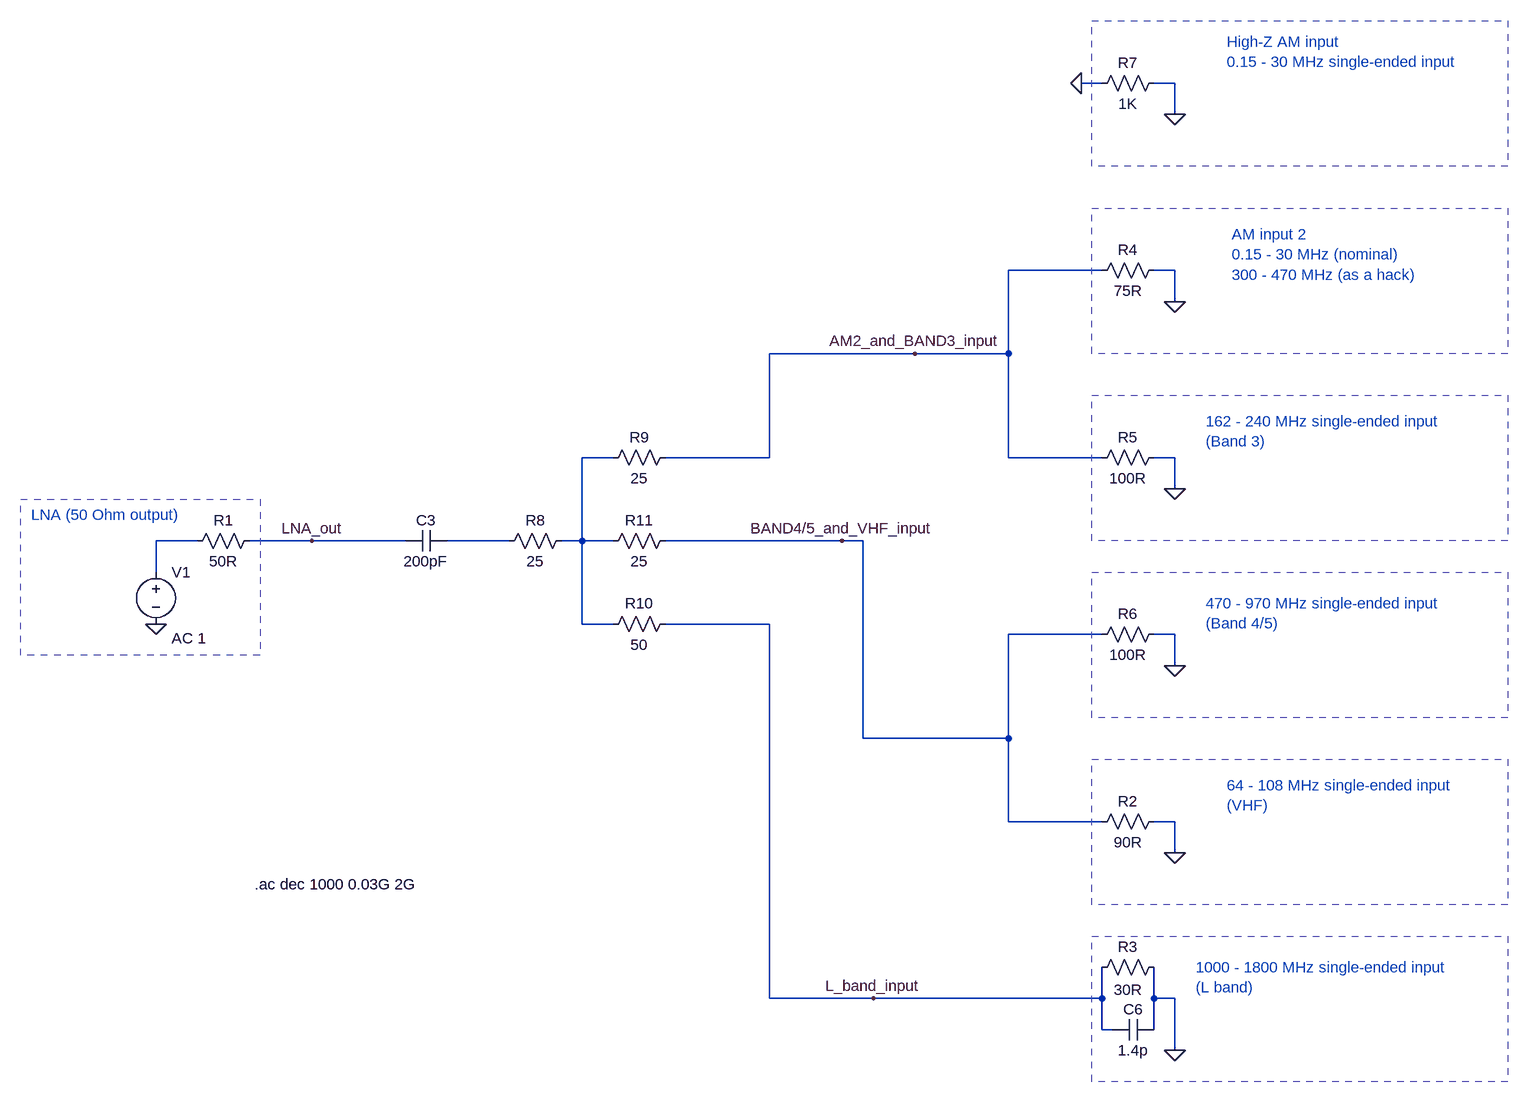
[diagram p0: schematic antenna_input_coupling_resistive_1.1.asc]
antenna_input_coupling_resistive_1.1.asc, the LTspice schematic file:
Version 4
SHEET 1 1332 1684
WIRE 464 -432 432 -432
WIRE 576 -432 544 -432
WIRE 576 -384 576 -432
WIRE 464 -144 320 -144
WIRE 576 -144 544 -144
WIRE 576 -96 576 -144
WIRE 176 -16 -48 -16
WIRE 320 -16 320 -144
WIRE 320 -16 176 -16
WIRE -288 144 -336 144
WIRE -48 144 -48 -16
WIRE -48 144 -208 144
WIRE 320 144 320 -16
WIRE 464 144 320 144
WIRE 576 144 544 144
WIRE 576 192 576 144
WIRE -928 272 -992 272
WIRE -752 272 -848 272
WIRE -608 272 -752 272
WIRE -448 272 -544 272
WIRE -336 272 -336 144
WIRE -336 272 -368 272
WIRE -288 272 -336 272
WIRE 64 272 -208 272
WIRE 96 272 64 272
WIRE -992 320 -992 272
WIRE -336 400 -336 272
WIRE -288 400 -336 400
WIRE -48 400 -208 400
WIRE 464 416 320 416
WIRE 576 416 544 416
WIRE 576 464 576 416
WIRE 96 576 96 272
WIRE 320 576 320 416
WIRE 320 576 96 576
WIRE 320 704 320 576
WIRE 464 704 320 704
WIRE 576 704 544 704
WIRE 576 752 576 704
WIRE -48 976 -48 400
WIRE 112 976 -48 976
WIRE 464 976 464 928
WIRE 464 976 112 976
WIRE 544 976 544 928
WIRE 576 976 544 976
WIRE 464 1024 464 976
WIRE 480 1024 464 1024
WIRE 544 1024 544 976
WIRE 576 1056 576 976
FLAG -992 400 0
FLAG 576 752 0
FLAG 576 192 0
FLAG 576 464 0
FLAG 576 1056 0
FLAG 576 -96 0
FLAG 576 -384 0
FLAG 432 -432 0
FLAG -752 272 LNA_out
FLAG 176 -16 AM2_and_BAND3_input
FLAG 64 272 BAND4/5_and_VHF_input
FLAG 112 976 L_band_input
SYMBOL res -832 256 R90
WINDOW 0 0 56 VBottom 2
WINDOW 3 32 56 VTop 2
SYMATTR InstName R1
SYMATTR Value 50R
SYMBOL voltage -992 304 R0
WINDOW 123 24 118 Left 2
SYMATTR Value2 AC 1
SYMATTR InstName V1
SYMATTR Value ""
SYMBOL res 560 688 R90
WINDOW 0 0 56 VBottom 2
WINDOW 3 32 56 VTop 2
SYMATTR InstName R2
SYMATTR Value 90R
SYMBOL res 560 128 R90
WINDOW 0 0 56 VBottom 2
WINDOW 3 32 56 VTop 2
SYMATTR InstName R5
SYMATTR Value 100R
SYMBOL res 560 400 R90
WINDOW 0 0 56 VBottom 2
WINDOW 3 32 56 VTop 2
SYMATTR InstName R6
SYMATTR Value 100R
SYMBOL res 560 912 R90
WINDOW 0 0 56 VBottom 2
WINDOW 3 35 56 VTop 2
SYMATTR InstName R3
SYMATTR Value 30R
SYMBOL res 560 -160 R90
WINDOW 0 0 56 VBottom 2
WINDOW 3 32 56 VTop 2
SYMATTR InstName R4
SYMATTR Value 75R
SYMBOL res 560 -448 R90
WINDOW 0 0 56 VBottom 2
WINDOW 3 32 56 VTop 2
SYMATTR InstName R7
SYMATTR Value 1K
SYMBOL cap 480 1040 R270
WINDOW 0 32 32 VTop 2
WINDOW 3 0 32 VBottom 2
SYMATTR InstName C6
SYMATTR Value 1.4p
SYMBOL cap -544 256 R90
WINDOW 0 0 32 VBottom 2
WINDOW 3 32 32 VTop 2
SYMATTR InstName C3
SYMATTR Value 200pF
SYMBOL res -352 256 R90
WINDOW 0 0 56 VBottom 2
WINDOW 3 32 56 VTop 2
SYMATTR InstName R8
SYMATTR Value 25
SYMBOL res -192 128 R90
WINDOW 0 0 56 VBottom 2
WINDOW 3 32 56 VTop 2
SYMATTR InstName R9
SYMATTR Value 25
SYMBOL res -192 384 R90
WINDOW 0 0 56 VBottom 2
WINDOW 3 32 56 VTop 2
SYMATTR InstName R10
SYMATTR Value 50
SYMBOL res -192 256 R90
WINDOW 0 0 56 VBottom 2
WINDOW 3 32 56 VTop 2
SYMATTR InstName R11
SYMATTR Value 25
TEXT -840 800 Left 2 !.ac dec 1000 0.03G 2G
TEXT -1184 232 Left 2 ;LNA (50 Ohm output)
TEXT 656 648 Left 2 ;64 - 108 MHz single-ended input\n(VHF)
TEXT 624 88 Left 2 ;162 - 240 MHz single-ended input\n(Band 3)
TEXT 624 368 Left 2 ;470 - 970 MHz single-ended input\n(Band 4/5)
TEXT 608 928 Left 2 ;1000 - 1800 MHz single-ended input\n(L band)
TEXT 664 -200 Left 2 ;AM input 2\n0.15 - 30 MHz (nominal)\n300 - 470 MHz (as a hack)
TEXT 656 -496 Left 2 ;High-Z AM input\n0.15 - 30 MHz single-ended input
RECTANGLE Normal -1200 208 -832 448 2
RECTANGLE Normal 1088 832 448 608 2
RECTANGLE Normal 1088 272 448 48 2
RECTANGLE Normal 1088 544 448 320 2
RECTANGLE Normal 1088 1104 448 880 2
RECTANGLE Normal 1088 -16 448 -240 2
RECTANGLE Normal 1088 -304 448 -528 2

The netlist it stands for:
* antenna_input_coupling_resistive_1.1.asc
R1 LNA_out N002 50R
V1 N002 0 AC 1
R2 0 BAND4/5_and_VHF_input 90R
R5 0 AM2_and_BAND3_input 100R
R6 0 BAND4/5_and_VHF_input 100R
R3 0 L_band_input 30R
R4 0 AM2_and_BAND3_input 75R
R7 0 0 1K
C6 L_band_input 0 1.4p
C3 N003 LNA_out 200pF
R8 N001 N003 25
R9 AM2_and_BAND3_input N001 25
R10 L_band_input N001 50
R11 BAND4/5_and_VHF_input N001 25
.ac dec 1000 0.03G 2G
* LNA (50 Ohm output)
* 64 - 108 MHz single-ended input
* (VHF)
* 162 - 240 MHz single-ended input
* (Band 3)
* 470 - 970 MHz single-ended input
* (Band 4/5)
* 1000 - 1800 MHz single-ended input
* (L band)
* AM input 2
* 0.15 - 30 MHz (nominal)
* 300 - 470 MHz (as a hack)
* High-Z AM input
* 0.15 - 30 MHz single-ended input
.backanno
.end